# EAGLE design main1 (EAGLE 9.2.0)
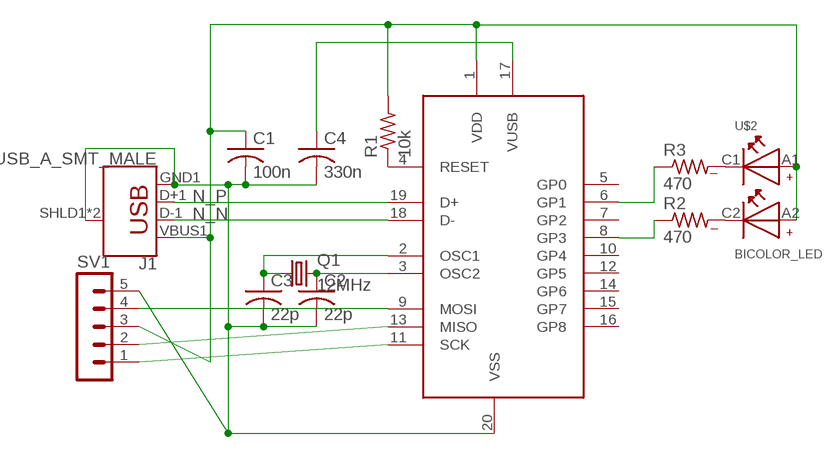
[diagram p0: schematic, sheet 1]

## Parts
C1  100n  C-USC0805  [C0805]
C2  22p  C-USC0603  [C0603]
C3  22p  C-USC0603  [C0603]
C4  330n  C-USC0603  [C0603]
J1  USB_A_SMT_MALE  [USB-A-SMT-MALE]
Q1  12MHz  CRYSTALSM49  [SM49]
R1  10k  R-US_R0603  [R0603]
R2  470  R-US_R0603  [R0603]
R3  470  R-US_R0603  [R0603]
SV1  MA05-1  [MA05-1]
U$1  MCP2210  [SOIC20_GENERIC]
U$2  BICOLOR_LED  [BICOLOR_LED]

## Nets
N$3: C1.2 C2.2 C3.2 C4.2 J1.GND1(GND) J1.SHLD1(SHIELD) J1.SHLD2(SHIELD) SV1.5 U$1.20(VSS)
N$4: C1.1 J1.VBUS1(VBUS) R1.2 SV1.3 U$1.1(VDD) U$2.A1 U$2.A2
N$5: C3.1 Q1.1 U$1.2(OSC1)
N$6: C2.1 Q1.2 U$1.3(OSC2)
N$7: C4.1 U$1.17(VUSB)
N$8: R1.1 U$1.4(RESET)
N$9: R2.2 U$2.C2
N$10: R3.2 U$2.C1
N$11: R3.1 U$1.6(GP1)
N$12: R2.1 U$1.8(GP3)
N$13: SV1.1 U$1.11(SCK)
N$14: SV1.2 U$1.13(MISO)
N$15: SV1.4 U$1.9(MOSI)
N_N: J1.D-1(D-) U$1.18(D-)
N_P: J1.D+1(D+) U$1.19(D+)
Unconnected: U$1.5(GP0) U$1.7(GP2) U$1.10(GP4) U$1.12(GP5) U$1.14(GP6) U$1.15(GP7) U$1.16(GP8)

## Library data of the parts
C1-C4 = rcl:C-US: CAPACITOR, American symbol; SPICEPREFIX: C
J1 = SparkFun-Connectors:USB_A: USB-A Connector Male and female variants, as well as PTH and SMT variants SparkFun Products: SparkFun XBee Explorer Dongle <https://www.sparkfun.com/products/11697> PTH Male SparkFun MicroView-USB Programmer <https://www.sparkfun.com/products/12924> SMT Male SparkFun USB Type A Female Breakout <https://www.sparkfun.com/products/12700> SMT Female; PROD_ID: CONN-11499
Q1 = crystal:CRYSTAL: CRYSTAL; OC_FARNELL: unknown; OC_NEWARK: unknown
R1-R3 = resistor:R-US_: RESISTOR, American symbol
SV1 = con-lstb:MA05-1: PIN HEADER; OC_FARNELL: unknown; OC_NEWARK: unknown
U$1 = 7_segment_lib:MCP2210
U$2 = 7_segment_lib:BICOLOR_LED

## Board
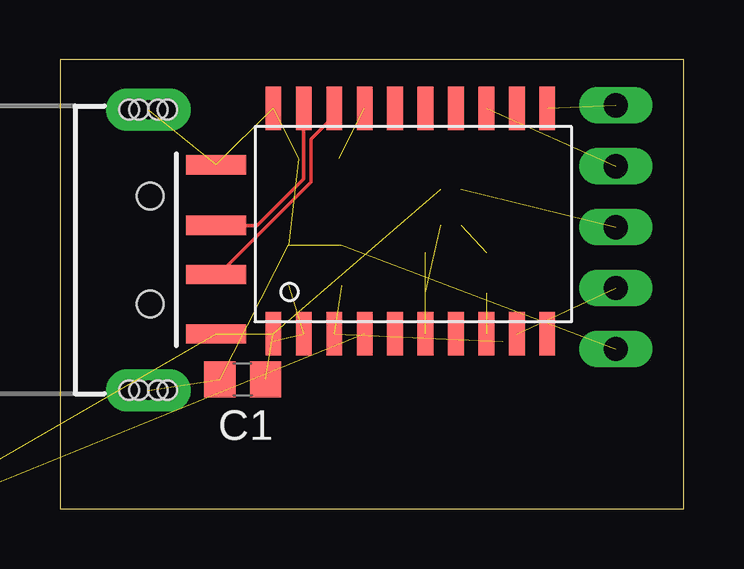
[diagram p1: board, top side]
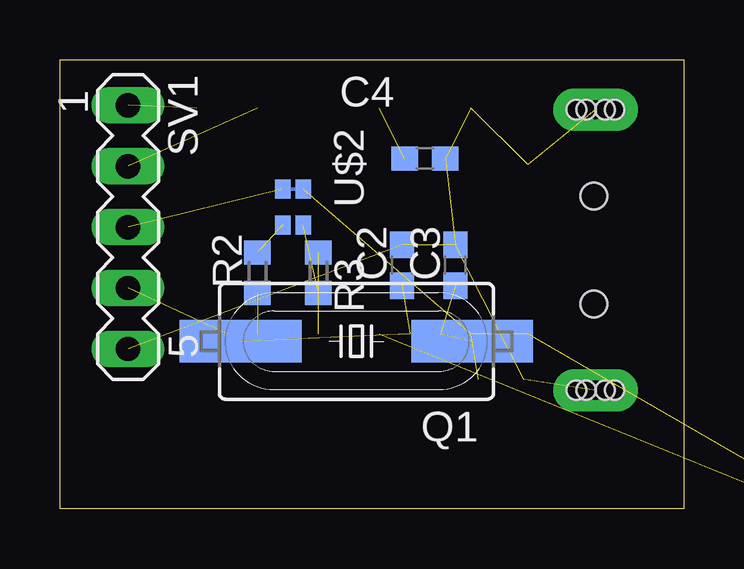
[diagram p2: board, bottom side, seen from below]

Size 26.02 x 18.72 mm. Coordinates in mm from the lower left corner, seen from the top.
Outline: 0,0 26.02,0 26.02,18.72 0,18.72 0,0
Copper layers (1*16): Top 0.035mm / dielectric 1.5mm / Bottom 0.035mm
Design rules "default": minimum track width 6mil, minimum drill 0.35mm, track to track 6mil, track to pad 6mil, pad to pad 6mil, via to via 6mil, smd to smd 6mil, copper to edge 40mil, drill to drill 6mil, minimum pad ring 10mil, minimum via ring 8mil, stop-mask expansion 4mil, vias tented up to drill 0mil, thermal gap 10mil

### Footprints (pad centres in the part's own frame; a part is rotated, then mirrored left to right if it is on the bottom)
C0805 = smd 1.3 x 1.5: 1 -0.95,0; 2 0.95,0
C0603 = smd 1.1 x 1: 1 -0.85,0; 2 0.85,0
USB-A-SMT-MALE = smd 2.5 x 0.8: D+1 10.95,1.027; D-1 10.95,-1.027; GND1 10.95,3.551; VBUS1 10.95,-3.5 | drill 0.8 pad 1.778 long: SHLD1 8.13,-5.85; SHLD2 8.13,5.85 | hole 1.1: 8.2,2.25; 8.2,-2.25 | hole 0.8: 8.53,-5.85; 8.93,-5.85; 7.73,-5.85; 7.33,-5.85; 8.53,5.85; 8.93,5.85; 7.73,5.85; 7.33,5.85
SM49 = smd 5.08 x 1.778: 1 -4.826,0; 2 4.826,0
R0603 = smd 1 x 1.1: 1 -0.85,0; 2 0.85,0
MA05-1 = drill 1.016 long: 1 -5.08,0; 2 -2.54,0; 3 0,0; 4 2.54,0; 5 5.08,0
SOIC20_GENERIC = smd 1.8 x 0.65: 1 -5.08,6.35; 2 -5.08,5.08; 3 -5.08,3.81; 4 -5.08,2.54; 5 -5.08,1.27; 6 -5.08,0; 7 -5.08,-1.27; 8 -5.08,-2.54; 9 -5.08,-3.81; 10 -5.08,-5.08; 11 4.32,-5.08; 12 4.32,-3.81; 13 4.32,-2.54; 14 4.32,-1.27; 15 4.32,0; 16 4.32,1.27; 17 4.32,2.54; 18 4.32,3.81; 19 4.32,5.08; 20 4.32,6.35
BICOLOR_LED = smd 0.8 x 0.65: A1 0,0; A2 0,-0.85; C1 1.5,0; C2 1.5,-0.85

### Placement (x,y rotation side)
C1  7.62,5.4 180 top
C2  11.75,10.16 90 bottom
C3  9.53,10.16 90 bottom
C4  10.79,14.61 0 bottom
J1  -4.45,10.79 0 top
Q1  13.65,6.99 180 bottom
R1  -13.02,-3.49 0 top  (outside the outline)
R2  17.78,9.84 90 bottom
R3  15.24,9.84 270 bottom
SV1  23.18,11.75 270 bottom
U$1  15.24,12.38 90 top
U$2  15.88,13.34 270 bottom

### Tracks (layer width: path | path; a pad name or v marks a point on that pad's centre or on a via)
N$3  (8 unrouted)
N$4  (5 unrouted)
  Bottom 0.152: U$2.A1 U$2.A2
N$5  (2 unrouted)
N$6  (2 unrouted)
N$7  (1 unrouted)
N$8  (1 unrouted)
N$9  (1 unrouted)
N$10  (1 unrouted)
N$11  (1 unrouted)
N$12  (1 unrouted)
N$13  (1 unrouted)
N$14  (1 unrouted)
N$15  (1 unrouted)
N_N
  Top 0.152: J1.D-1 6.61,9.77 8.44,11.6 10.46,13.63 10.46,15.42 11.43,16.38 U$1.18
N_P
  Top 0.152: J1.D+1 8.22,11.82 10.16,13.75 10.16,15.42 U$1.19